# Altium schematic sheet FPGA_RGB_LED_Matrix.SchDoc
size A4; Date: 07/05/2016; CheckedBy: Javier Guillemat; Author: Javier Jiménez; CompanyName: Guilletronic; Organization: Guilletronic; Address1: Calle del Cel Nº14; Address2: Las Colinas; Address3: 08818 Olivella; DocumentNumber: 6; Revision: A; SheetNumber: 6; SheetTotal: 6
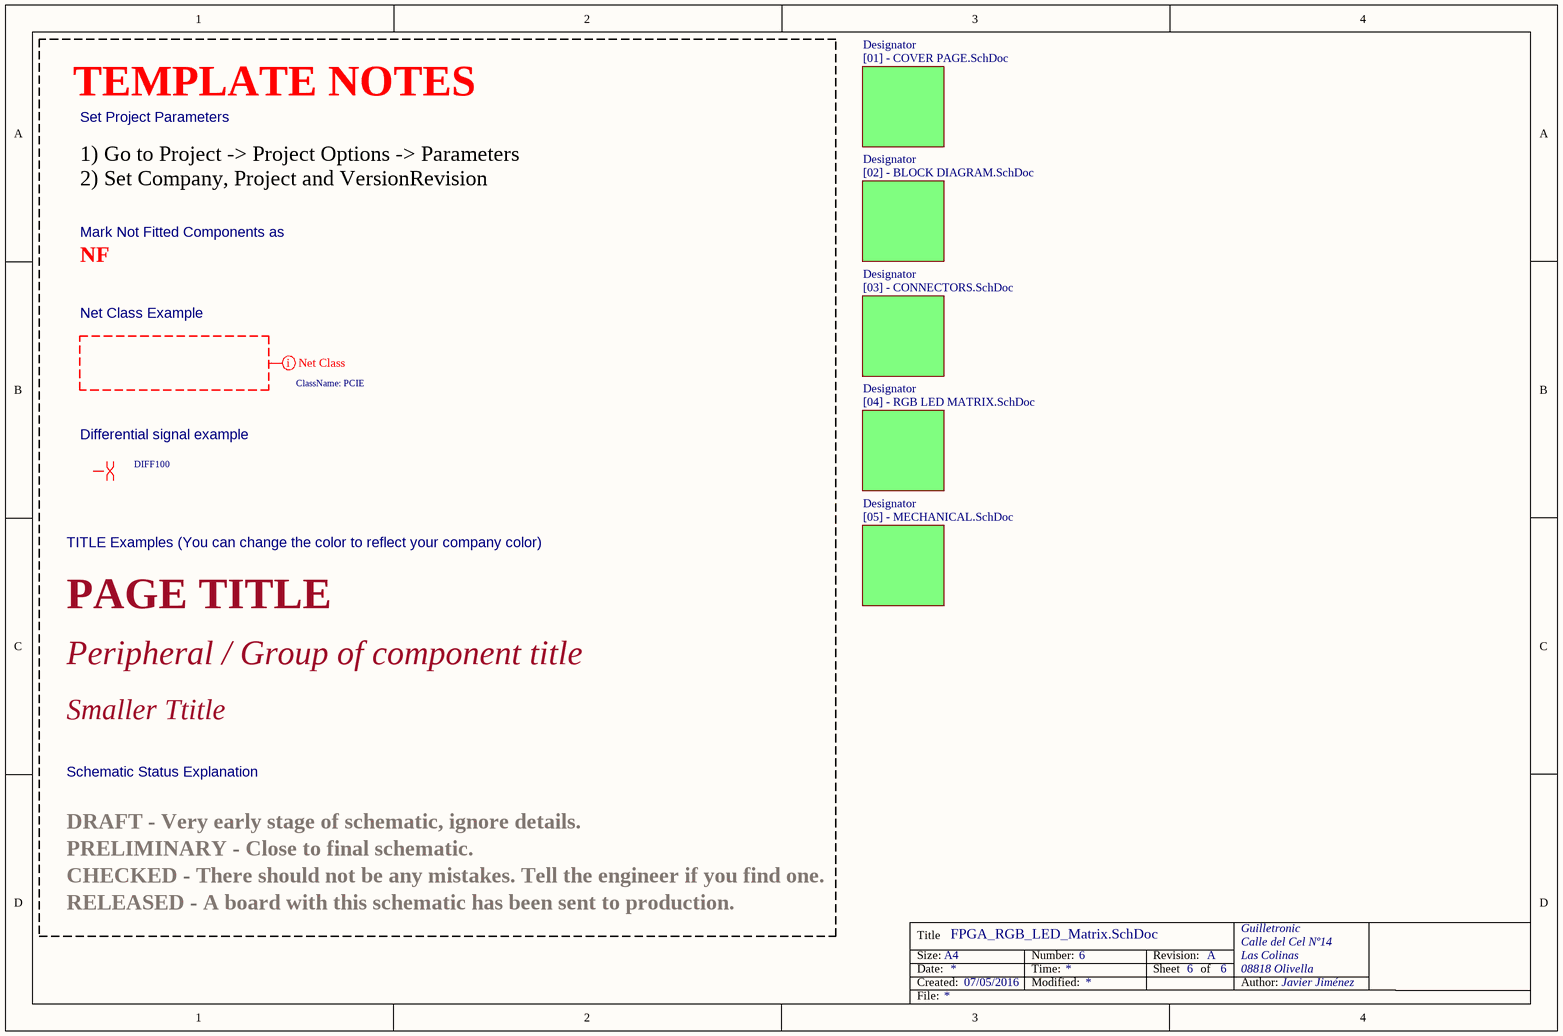
[diagram p0: FPGA_RGB_LED_Matrix.SchDoc]

## Sub-sheets
Designator = [01] - COVER PAGE.SchDoc: no entries
Designator = [02] - BLOCK DIAGRAM.SchDoc: no entries
Designator = [03] - CONNECTORS.SchDoc: no entries
Designator = [04] - RGB LED MATRIX.SchDoc: no entries
Designator = [05] - MECHANICAL.SchDoc: no entries

## Layout directives
net class PCIE: (no net found under the mark)
differential pair; net class DIFF100: (no net found under the mark)

## Notes on the sheet
- TEMPLATE NOTES
- Set Project Parameters
- 1) Go to Project -> Project Options -> Parameters
  2) Set Company, Project and VersionRevision
- Mark Not Fitted Components as
- NF
- Net Class Example
- Differential signal example
- TITLE Examples (You can change the color to reflect your company color)
- PAGE TITLE
- Peripheral / Group of component title
- Schematic Status Explanation
- Smaller Ttitle
- DRAFT - Very early stage of schematic, ignore details.
- PRELIMINARY - Close to final schematic.
- RELEASED - A board with this schematic has been sent to production.
- CHECKED - There should not be any mistakes. Tell the engineer if you find one.
- Title
- Size:
- Date:
- Created:
- A4
- Number:
- Time:
- Modified:
- Revision:
- Sheet
- of
- Author:
- File: